# Altium project Brain Storm 2024.PrjPcb
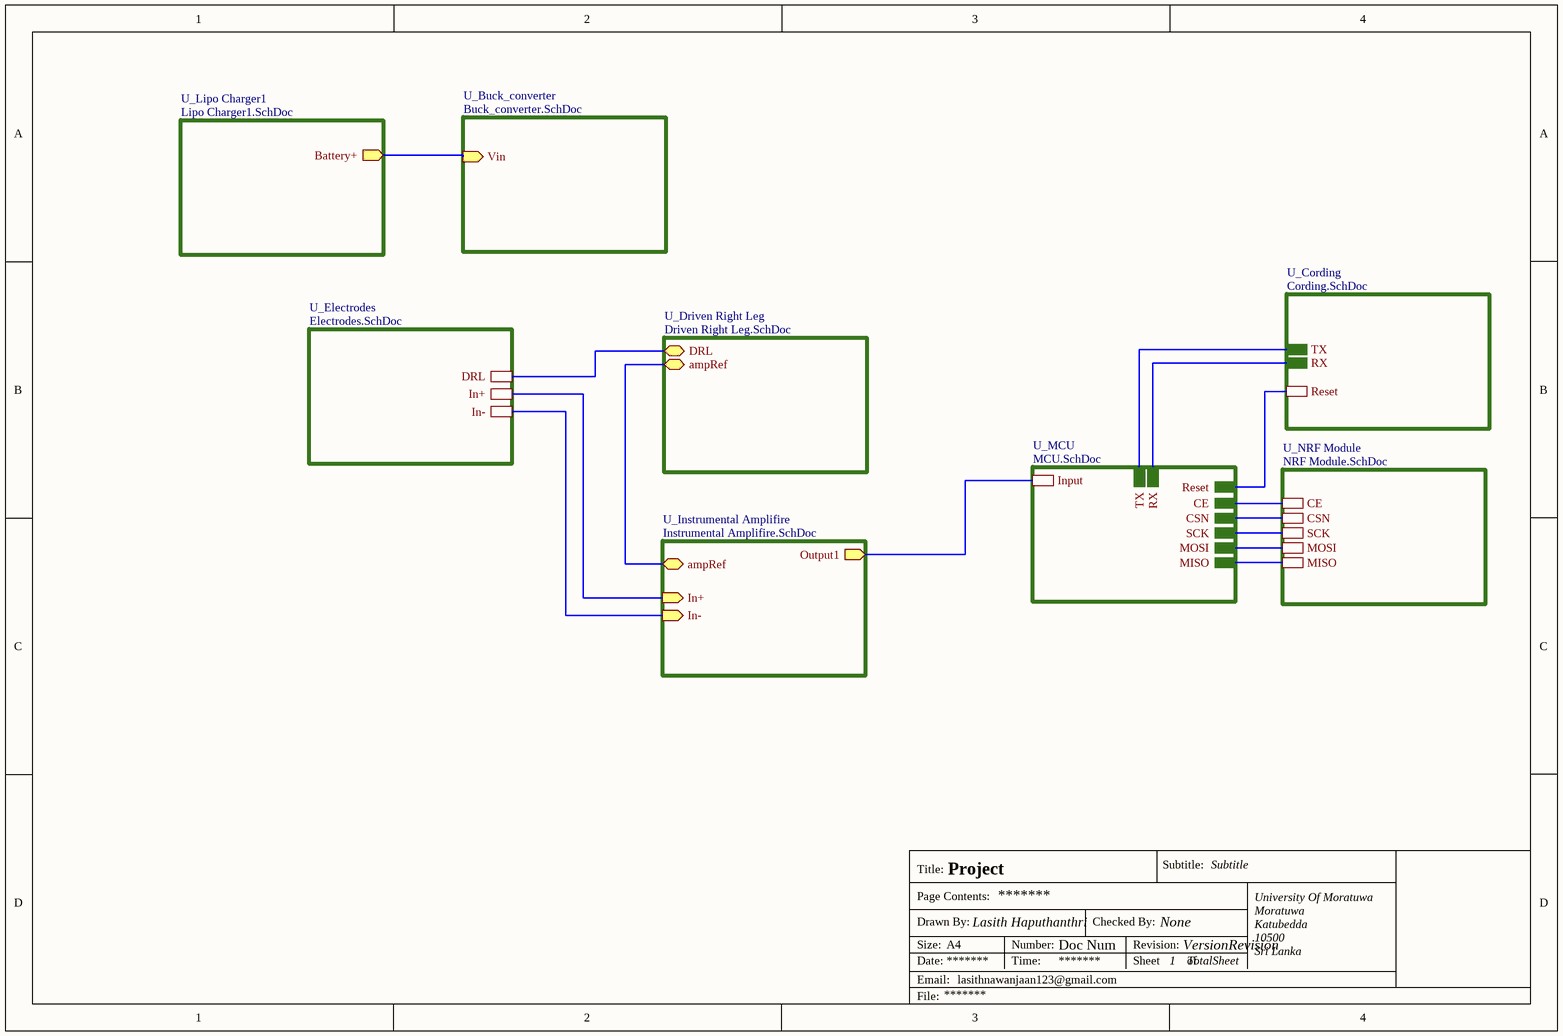
[diagram p0: Spectacles.SchDoc]
8 sheets, 64 parts. Net scope: hierarchical (ports join the sheet entries above them; power ports are global).
Board file: Spectacles.PcbDoc
Sheets:
  Spectacles.SchDoc
    U_Electrodes = Electrodes.SchDoc
    U_Driven Right Leg = Driven Right Leg.SchDoc
    U_Instrumental Amplifire = Instrumental Amplifire.SchDoc
    U_MCU = MCU.SchDoc
    U_NRF Module = NRF Module.SchDoc
    U_Lipo Charger1 = Lipo Charger1.SchDoc
    U_Cording = Cording.SchDoc

## Sheet Spectacles.SchDoc: Title
size A4; Date: *******; ApprovedBy: *******; CheckedBy: None; Author: *******; CompanyName: *******; DrawnBy: Name; Engineer: *******; Organization: *******; Address1: *******; Address2: *******; Address3: *******; Address4: *******; DocumentNumber: Doc Num; Revision: *******; SheetNumber: 1; SheetTotal: 9; Subtitle: Subtitle; Project: Project; VersionRevision: VersionRevision; TotalSheet: TotalSheet; CurrentTime: *******; CurrentDate: *******; Time: *******; DocumentFullPathAndName: *******; DocumentName: *******; ModifiedDate: *******; ImagePath: *******; ProjectName: *******; Application_BuildNumber: *******

### Sub-sheets
U_Buck_converter = Buck_converter.SchDoc (file not in this document): Vin (in)
U_Cording = Cording.SchDoc: Reset, TX, RX
U_Driven Right Leg = Driven Right Leg.SchDoc: DRL (bidir), ampRef (bidir)
U_Electrodes = Electrodes.SchDoc: DRL, In-, In+
U_Instrumental Amplifire = Instrumental Amplifire.SchDoc: In- (in), In+ (in), ampRef (bidir), Output1 (out)
U_Lipo Charger1 = Lipo Charger1.SchDoc: Battery+ (out)
U_MCU = MCU.SchDoc: Input, CE, MOSI, MISO, SCK, CSN, Reset, TX, RX
U_NRF Module = NRF Module.SchDoc: CE, CSN, SCK, MOSI, MISO

### Nets
CE: sheet U_MCU/CE, sheet U_NRF Module/CE
CSN: sheet U_MCU/CSN, sheet U_NRF Module/CSN
MISO: sheet U_MCU/MISO, sheet U_NRF Module/MISO
MOSI: sheet U_MCU/MOSI, sheet U_NRF Module/MOSI
RST: sheet U_MCU/Reset, sheet U_Cording/Reset
SCK: sheet U_MCU/SCK, sheet U_NRF Module/SCK
NetC28_1: sheet U_Lipo Charger1/Battery+, sheet U_Buck_converter/Vin
NetDuty1_1: sheet U_Electrodes/In+, sheet U_Instrumental Amplifire/In+
NetDuty1_2: sheet U_Electrodes/In-, sheet U_Instrumental Amplifire/In-
NetDuty1_3: sheet U_Electrodes/DRL, sheet U_Driven Right Leg/DRL
NetR2_1: sheet U_Driven Right Leg/ampRef, sheet U_Instrumental Amplifire/ampRef
NetR5_1: sheet U_Instrumental Amplifire/Output1, sheet U_MCU/Input
NetR22_1: sheet U_MCU/TX, sheet U_Cording/TX
NetR23_1: sheet U_MCU/RX, sheet U_Cording/RX

### Notes on the sheet
- Title:
- Drawn By:
- Page Contents:
- Checked By:
- Subtitle:
- University Of Moratuwa
- Moratuwa
- Size:
- Date:
- File:
- Email:
- A4
- lasithnawanjaan123@gmail.com
- Lasith Haputhanthri
- Number:
- Time:
- Revision:
- Sheet
- of
- Katubedda
- 10500
- Sri Lanka

## Sheet Electrodes.SchDoc: Title
size A4; Date: *******; ApprovedBy: *******; CheckedBy: None; Author: *******; CompanyName: *******; DrawnBy: Name; Engineer: *******; Organization: *******; Address1: *******; Address2: *******; Address3: *******; Address4: *******; DocumentNumber: Doc Num; Revision: *******; SheetNumber: 2; SheetTotal: 5; Subtitle: Subtitle; Project: Project; VersionRevision: VersionRevision; TotalSheet: TotalSheet; CurrentTime: *******; CurrentDate: *******; Time: *******; DocumentFullPathAndName: *******; DocumentName: *******; ModifiedDate: *******; ImagePath: *******; ProjectName: *******; Application_BuildNumber: *******
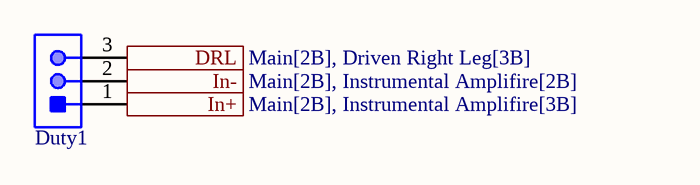
[diagram p1: Electrodes.SchDoc]

### Parts
Duty1  171825-3  [TECO-171825-3_V]  (value not drawn)

### Ports
DRL (see Main[2B], Driven Right Leg[3B]), In+ (see Main[2B], Instrumental Amplifire[3B]), In- (see Main[2B], Instrumental Amplifire[2B])

### Nets
NetDuty1_1: Duty1.1 ; port In+
NetDuty1_2: Duty1.2 ; port In-
NetDuty1_3: Duty1.3 ; port DRL

### Notes on the sheet
- Title:
- Drawn By:
- Page Contents:
- Checked By:
- Subtitle:
- University Of Moratuwa
- Moratuwa
- Size:
- Date:
- File:
- Email:
- A4
- lasithnawanjaan123@gmail.com
- Lasith Haputhanthri
- Number:
- Time:
- Revision:
- Sheet
- of
- Katubedda
- 10500
- Sri Lanka

### Library data of the parts
Duty1 = CMP-2000-07494-1: Male Header, Pitch 2.5 mm, 1 x 3 Position, Height 10.4 mm, Tail Length 3.6 mm, / -20 to 95 degC / , RoHS, Bulk; Manufacturer: TE Connectivity; Mating Alignment: Yes(With); Tail Length: 0.142inch; Mating Post Length: 7.5mm; PCB Thickness: 0.063inch; PCB Mount Alignment: No(Without); Voltage Rating: 350V; Max Voltage Rating (AC): 250V; Plating Thickness: 0.8um; PCB Mounting Orientation: Vertical; Number of Positions: 3; PCB Mount Retention: Without; Max Current Rating: 3.5A; Max Voltage Rating (DC): 350.25kV; Pitch: 2.5mm; Approvals: UL; Contact Resistance: 20mOhm; Mount: ThroughHole; Length: 7.5mm; Orientation: Straight; Contact Mating Length: 0.295inch; Contact Material: Brass; Housing Material: Nylon; Package Description: Male Header, Pitch 2.5 mm, 1 x 3 Position, Height 10.4 mm, Tail Length 3.6 mm; Colour: Natural; Backwall/Post Interruptions: No(Without); Min Operating Temperature: -20degC; Mating Retention: Yes(With); Connector Type: Header; Packaging: Bag; RoHSCompliant: True; Package Reference: 171825-3; Contact Shape: Square; Strain Relief: No(Without); Contact Gender: Male; Number of Contacts: 3; Manufacturer URL: http://www.te.com/; Height: 0.409inch; Contact Retention: No(Without); Datasheet Version: Rev. Y3, 12/2016; Panel Mount Retention: No(Without); Datasheet URL: http://www.te.com/commerce/DocumentDelivery/DDEController?Action=showdoc&DocId=Customer+Drawing%7F171825%7FY3%7Fpdf%7FEnglish%7FENG_CD_171825_Y3.pdf%7F171825-3; Termination: Solder; Mounting Technology: ThroughHole; Max Operating Temperature: 95degC; Flammability Rating: UL94V-0; REACH SVHC: NoSVHC; Housing Colour: Natural; Package Quantity: 1000; Number of Rows: 1; Depth: 4.9mm; Contact Plating: Tin

## Sheet Driven Right Leg.SchDoc: Title
size A4; Date: *******; ApprovedBy: *******; CheckedBy: None; Author: *******; CompanyName: *******; DrawnBy: Name; Engineer: *******; Organization: *******; Address1: *******; Address2: *******; Address3: *******; Address4: *******; DocumentNumber: Doc Num; Revision: *******; SheetNumber: 3; SheetTotal: 9; Subtitle: Subtitle; Project: Project; VersionRevision: VersionRevision; TotalSheet: TotalSheet; CurrentTime: *******; CurrentDate: *******; Time: *******; DocumentFullPathAndName: *******; DocumentName: *******; ModifiedDate: *******; ImagePath: *******; ProjectName: *******; Application_BuildNumber: *******
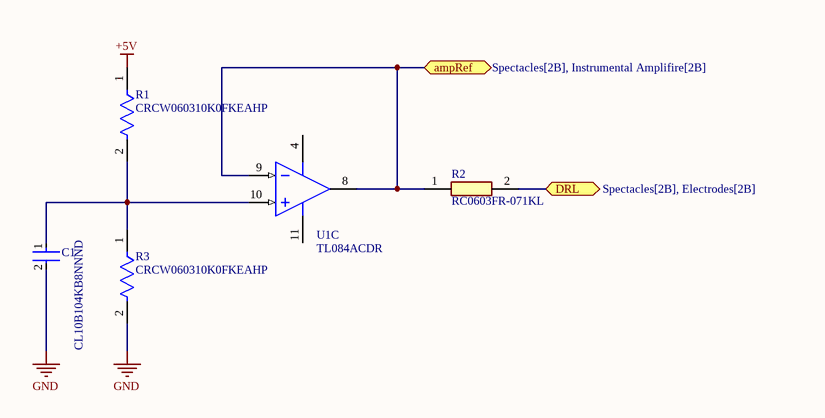
[diagram p2: Driven Right Leg.SchDoc]

### Parts
C1  CL10B104KB8NNND  [FP-CL10-IPC_A]
R1  CRCW060310K0FKEAHP  [FP-CRCW0603-HPe3-MFG]
R2  RC0603FR-071KL  [RESC1608X55N]
R3  CRCW060310K0FKEAHP  [FP-CRCW0603-HPe3-MFG]
U1  TL084ACDR  [D0014A_N]  (part C of 4)

### Ports
ampRef (bidir, see Spectacles[2B], Instrumental Amplifire[2B]), DRL (bidir, see Spectacles[2B], Electrodes[2B])

### Nets
+5V: R1.1 U1.4(VCC+)
GND: C1.2 R3.2 U1.11(VCC-)
NetC1_1: C1.1 R1.2 R3.1 U1.10(IN3+)
NetDuty1_3: R2.2 ; port DRL
NetR2_1: R2.1 U1.8(OUT3) U1.9(IN3-) ; port ampRef

### Notes on the sheet
- Title:
- Drawn By:
- Page Contents:
- Checked By:
- Subtitle:
- University Of Moratuwa
- Moratuwa
- Size:
- Date:
- File:
- Email:
- A4
- lasithnawanjaan123@gmail.com
- Lasith Haputhanthri
- Number:
- Time:
- Revision:
- Sheet
- of
- Katubedda
- 10500
- Sri Lanka

### Library data of the parts
C1 = CMP-13271-000587-1: Cap Ceramic 100nF 50V X7R ±10% Pad SMD 0603 +125°C T/R; Case/Package: 0603; Depth: 0.8mm; Max Operating Temperature: 125°C; Lead Free: Lead Free; Material: Ceramic; Voltage Rating: 50V; Min Operating Temperature: -55°C; Voltage Rating (DC): 50V; Dielectric: X7R; Height: 0.8mm; Capacitance: 100nF; Thickness: 0.035inch; Radiation Hardening: No; Voltage: 50V; Packaging: Tape and Reel; Length: 1.6mm; Tolerance: 10%; Width: 0.031inch; Mount: Surface Mount; Package Quantity: 10000
R1 R3 = CMP-2000-03835-2: RES SMD 10K OHM 1% 1/3W 0603; Resistance: 10kR; Voltage Rating (DC): 75V; Max Power Dissipation: 250mW; Temperature Coefficient: 100ppm/°C; Case Code (Metric): 1608; Features: Automotive AEC-Q200; Termination: SMD/SMT; Number of Terminations: 2; Case Code (Imperial): 0603; Tolerance: 1%; Depth: 0.85mm; Package Quantity: 10; Length: 1.6mm; Packaging: Tape and Reel; Contact Plating: Tin; Radiation Hardening: No; Case/Package: 0603; Composition: Thick Film; Voltage Rating: 75V; Weight: 7.1E-05oz; Max Operating Temperature: 155°C; Lead Free: Lead Free; Width: 0.033inch; Power Rating: 250mW; Min Operating Temperature: -55°C; Military Standard: Not; Height: 0.45mm
R2 = RC0603FR-071KL: Resistor; Manufacturer_Name: YAGEO; Datasheet Link: https://www.yageo.com/upload/media/product/productsearch/datasheet/rchip/PYu-RC_Group_51_RoHS_L_12.pdf; Height: 0.55mm; Manufacturer_Part_Number: RC0603FR-071KL; Mouser Part Number: 603-RC0603FR-071KL; Mouser Price/Stock: https://www.mouser.co.uk/ProductDetail/YAGEO/RC0603FR-071KL?qs=VU8sRB4EgwApHsk4rF%2F3zg%3D%3D; Arrow Part Number: RC0603FR-071KL; Arrow Price/Stock: https://www.arrow.com/en/products/rc0603fr-071kl/yageo?region=nac
U1 = CMP-0015-00026-2: JFET-Input Operational Amplifier, 7 to 36 V, 0 to 70 degC, 14-pin SOIC (D14), Green (RoHS & no Sb/Br); Manufacturer: Texas Instruments; Total Supply Voltage(Min)(+5V is 5, +/-5V is 10): 7; Rating: Catalog; Total Supply Voltage(Max)(+5V is 5, +/-5V is 10): 36; Vio (25C)(Max)(mV): 6; CMRR(Min)(dB): 75; Iq per channel(Max)(mA): 2.8; Offset Drift(Typ)(uV/C): 18; GBW(Typ)(MHz): 3; Slew Rate(Typ)(V/us): 13; Number of Channels: 4; Sub Family: General Purpose Amplifier, High Supply Voltage Amplifier (>=30V); IIB(Max)(pA): 200; Eco-Plan: Green (RoHS & no Sb/Br); ComponentLink2URL: http://www.ti.com/lit/ds/symlink/tl084a.pdf; ComponentLink2Description: Datasheet; PackageVersion: 4040047-5/M, 06/2011; Mounting Technology: Surface Mount; ComponentLink3Description: Package Specification; ComponentLink1Description: Manufacturer URL; PackageReference: D0014A; PartNumber: TL084ACDR; ComponentLink1URL: http://www.ti.com/; ComponentLink3URL: http://www.ti.com/lit/ml/mpds177g/mpds177g.pdf; PackageDescription: 14-Pin Plastic Small Outline, Body 8.65 x 3.90 mm, Pitch 1.27 mm; Code_JEDEC: MS-012; DatasheetVersion: SLOS081G; Vn at 1kHz(Typ)(nV/rtHz): 18

## Sheet Instrumental Amplifire.SchDoc: Title
size A4; Date: *******; ApprovedBy: *******; CheckedBy: None; Author: *******; CompanyName: *******; DrawnBy: Name; Engineer: *******; Organization: *******; Address1: *******; Address2: *******; Address3: *******; Address4: *******; DocumentNumber: Doc Num; Revision: *******; SheetNumber: 4; SheetTotal: 8; Subtitle: Subtitle; Project: Project; VersionRevision: VersionRevision; TotalSheet: TotalSheet; CurrentTime: *******; CurrentDate: *******; Time: *******; DocumentFullPathAndName: *******; DocumentName: *******; ModifiedDate: *******; ImagePath: *******; ProjectName: *******; Application_BuildNumber: *******
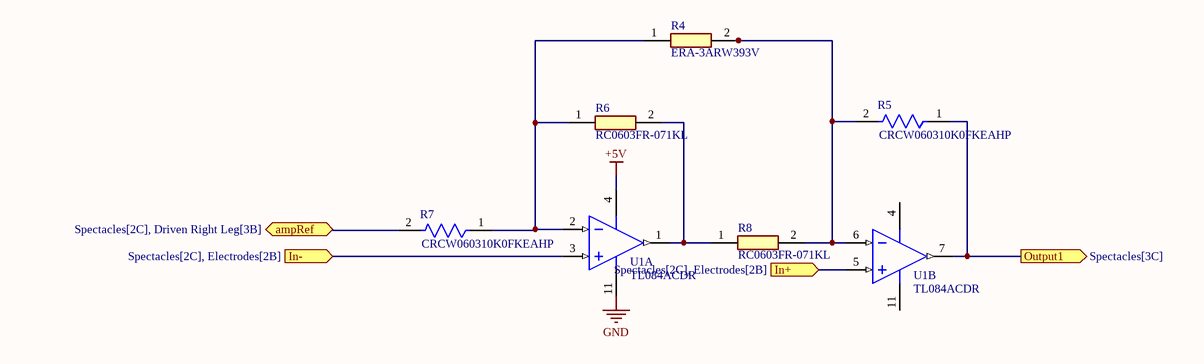
[diagram p3: Instrumental Amplifire.SchDoc]

### Parts
R4  ERA-3ARW393V  [ERA3AEB101V]
R5  CRCW060310K0FKEAHP  [FP-CRCW0603-HPe3-MFG]
R6  RC0603FR-071KL  [RESC1608X55N]
R7  CRCW060310K0FKEAHP  [FP-CRCW0603-HPe3-MFG]
R8  RC0603FR-071KL  [RESC1608X55N]
U1  TL084ACDR  [D0014A_N]  (parts A,B of 4)

### Ports
ampRef (bidir, see Spectacles[2C], Driven Right Leg[3B]), In+ (in, see Spectacles[2C], Electrodes[2B]), In- (in, see Spectacles[2C], Electrodes[2B]), Output1 (out, see Spectacles[3C])

### Nets
+5V: U1.4(VCC+)
GND: U1.11(VCC-)
NetDuty1_1: U1.5(IN2+) ; port In+
NetDuty1_2: U1.3(IN1+) ; port In-
NetR2_1: R7.2 ; port ampRef
NetR4_1: R4.1 R6.1 R7.1 U1.2(IN1-)
NetR4_2: R4.2 R5.2 R8.2 U1.6(IN2-)
NetR5_1: R5.1 U1.7(OUT2) ; port Output1
NetR6_2: R6.2 R8.1 U1.1(OUT1)

### Notes on the sheet
- Title:
- Drawn By:
- Page Contents:
- Checked By:
- Subtitle:
- University Of Moratuwa
- Moratuwa
- Size:
- Date:
- File:
- Email:
- A4
- lasithnawanjaan123@gmail.com
- Lasith Haputhanthri
- Number:
- Time:
- Revision:
- Sheet
- of
- Katubedda
- 10500
- Sri Lanka

### Library data of the parts
R4 = ERA-3ARW393V: Resistor; Manufacturer_Name: Panasonic; Datasheet Link: https://industrial.panasonic.com/cdbs/www-data/pdf/RDM0000/AOA0000C307.pdf; Height: 0.55mm; Manufacturer_Part_Number: ERA-3ARW393V; Mouser Part Number: 667-ERA-3ARW393V; Mouser Price/Stock: https://www.mouser.co.uk/ProductDetail/Panasonic/ERA-3ARW393V?qs=ob%252BdNz2%252BYEhCihxnNm%252BJJA%3D%3D
R5 R7 = CMP-2000-03835-2: as R1 on sheet Driven Right Leg; Case Code (Metric): 1608; Features: Automotive AEC-Q200; Termination: SMD/SMT; Number of Terminations: 2; Case Code (Imperial): 0603; Tolerance: 1%; Depth: 0.85mm; Package Quantity: 10; Length: 1.6mm; Packaging: Tape and Reel; Contact Plating: Tin; Radiation Hardening: No; Case/Package: 0603; Composition: Thick Film; Voltage Rating: 75V; Weight: 7.1E-05oz; Max Operating Temperature: 155°C; Lead Free: Lead Free; Width: 0.033inch; Power Rating: 250mW; Min Operating Temperature: -55°C; Military Standard: Not; Height: 0.45mm
R6 R8 = RC0603FR-071KL: Resistor; Manufacturer_Name: YAGEO; Datasheet Link: https://www.yageo.com/upload/media/product/productsearch/datasheet/rchip/PYu-RC_Group_51_RoHS_L_12.pdf; Height: 0.55mm; Manufacturer_Part_Number: RC0603FR-071KL; Mouser Part Number: 603-RC0603FR-071KL; Mouser Price/Stock: https://www.mouser.co.uk/ProductDetail/YAGEO/RC0603FR-071KL?qs=VU8sRB4EgwApHsk4rF%2F3zg%3D%3D; Arrow Part Number: RC0603FR-071KL; Arrow Price/Stock: https://www.arrow.com/en/products/rc0603fr-071kl/yageo?region=nac
U1 = CMP-0015-00026-2: as U1 on sheet Driven Right Leg; Eco-Plan: Green (RoHS & no Sb/Br); ComponentLink2URL: http://www.ti.com/lit/ds/symlink/tl084a.pdf; ComponentLink2Description: Datasheet; PackageVersion: 4040047-5/M, 06/2011; Mounting Technology: Surface Mount; ComponentLink3Description: Package Specification; ComponentLink1Description: Manufacturer URL; PackageReference: D0014A; PartNumber: TL084ACDR; ComponentLink1URL: http://www.ti.com/; ComponentLink3URL: http://www.ti.com/lit/ml/mpds177g/mpds177g.pdf; PackageDescription: 14-Pin Plastic Small Outline, Body 8.65 x 3.90 mm, Pitch 1.27 mm; Code_JEDEC: MS-012; DatasheetVersion: SLOS081G; Vn at 1kHz(Typ)(nV/rtHz): 18

## Sheet MCU.SchDoc: Title
size A4; Date: *******; ApprovedBy: *******; CheckedBy: None; Author: *******; CompanyName: *******; DrawnBy: Name; Engineer: *******; Organization: *******; Address1: *******; Address2: *******; Address3: *******; Address4: *******; DocumentNumber: Doc Num; Revision: *******; SheetNumber: 5; SheetTotal: 9; Subtitle: Subtitle; Project: Project; VersionRevision: VersionRevision; TotalSheet: TotalSheet; CurrentTime: *******; CurrentDate: *******; Time: *******; DocumentFullPathAndName: *******; DocumentName: *******; ModifiedDate: *******; ImagePath: *******; ProjectName: *******; Application_BuildNumber: *******
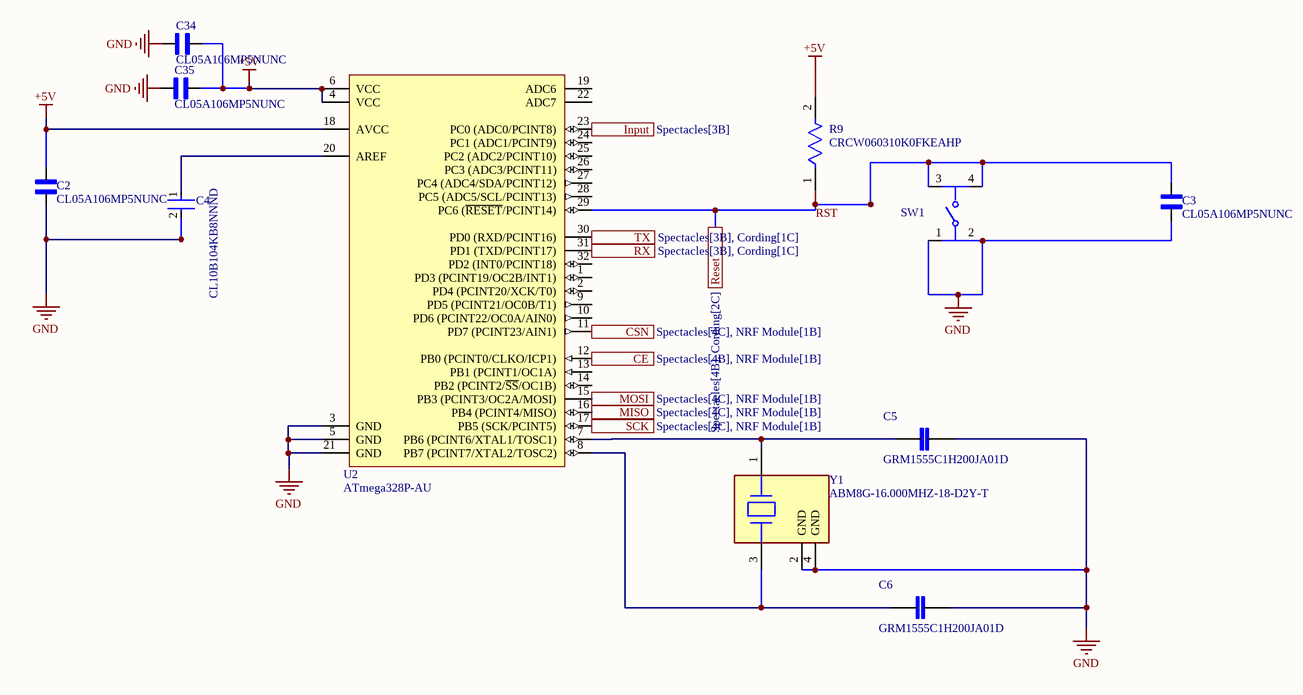
[diagram p4: MCU.SchDoc]

### Parts
C2  CL05A106MP5NUNC  [CAPC1005X55N]
C3  CL05A106MP5NUNC  [CAPC1005X55N]
C4  CL10B104KB8NNND  [FP-CL10-IPC_A]
C5  GRM1555C1H200JA01D  [CAPC1005X55N]
C6  GRM1555C1H200JA01D  [CAPC1005X55N]
C34  CL05A106MP5NUNC  [CAPC1005X55N]
C35  CL05A106MP5NUNC  [CAPC1005X55N]
R9  CRCW060310K0FKEAHP  [FP-CRCW0603-HPe3-MFG]
SW1  PTS526SK15SMTR2LFS  [FP-PTS526SK15SMTR2LFS-MFG]  (value not drawn)
U2  ATmega328P-AU  [32A_M]
Y1  ABM8G-16.000MHZ-18-D2Y-T  [FP-ABM8G-MFG]

### Ports
CE (see Spectacles[4B], NRF Module[1B]), CSN (see Spectacles[4C], NRF Module[1B]), Input (see Spectacles[3B]), MISO (see Spectacles[4C], NRF Module[1B]), MOSI (see Spectacles[4C], NRF Module[1B]), Reset (see Spectacles[4B], Cording[2C]), RX (see Spectacles[3B], Cording[1C]), SCK (see Spectacles[4C], NRF Module[1B]), TX (see Spectacles[3B], Cording[1C])

### Nets
+5V: C2.2 C34.1 C35.1 R9.2 U2.4(VCC) U2.6(VCC) U2.18(AVCC)
GND: C2.1 C3.1 C4.2 C5.1 C6.1 C34.2 C35.2 SW1.1 SW1.2 U2.3(GND) U2.5(GND) U2.21(GND) Y1.2(GND) Y1.4(GND)
CE: U2.12(PB0_(PCINT0/CLKO/ICP1)) ; port CE
CSN: U2.11(PD7_(PCINT23/AIN1)) ; port CSN
MISO: U2.16(PB4_(PCINT4/MISO)) ; port MISO
MOSI: U2.15(PB3_(PCINT3/OC2A/MOSI)) ; port MOSI
RST: C3.2 R9.1 SW1.3 SW1.4 U2.29(PC6_(~{RESET}/PCINT14)) ; port Reset
SCK: U2.17(PB5_(SCK/PCINT5)) ; port SCK
NetC4_1: C4.1 U2.20(AREF)
NetC5_2: C5.2 U2.7(PB6_(PCINT6/XTAL1/TOSC1)) Y1.1
NetC6_2: C6.2 U2.8(PB7_(PCINT7/XTAL2/TOSC2)) Y1.3
NetR5_1: U2.23(PC0_(ADC0/PCINT8)) ; port Input
NetR22_1: U2.30(PD0_(RXD/PCINT16)) ; port TX
NetR23_1: U2.31(PD1_(TXD/PCINT17)) ; port RX

Not connected (* = marked no-connect by the designer): U2 1(PD3_(PCINT19/OC2B/INT1)) 2(PD4_(PCINT20/XCK/T0)) 9(PD5_(PCINT21/OC0B/T1)) 10(PD6_(PCINT22/OC0A/AIN0)) 13(PB1_(PCINT1/OC1A)) 14(PB2_(PCINT2/~{SS}/OC1B)) 19(ADC6) 22(ADC7) 24(PC1_(ADC1/PCINT9)) 25(PC2_(ADC2/PCINT10)) 26(PC3_(ADC3/PCINT11)) 27(PC4_(ADC4/SDA/PCINT12)) 28(PC5_(ADC5/SCL/PCINT13)) 32(PD2_(INT0/PCINT18))

### Notes on the sheet
- Title:
- Drawn By:
- Page Contents:
- Checked By:
- Subtitle:
- University Of Moratuwa
- Moratuwa
- Size:
- Date:
- File:
- Email:
- A4
- lasithnawanjaan123@gmail.com
- Lasith Haputhanthri
- Number:
- Time:
- Revision:
- Sheet
- of
- Katubedda
- 10500
- Sri Lanka

### Library data of the parts
C2 C3 C34 C35 = CL05A106MP5NUNC: 10 ÂµF Â±20% 10V Ceramic Capacitor X5R 0402 (1005 Metric); Manufacturer Part Number: GRM188R61A106KE69D; Manufacturer: Murata; Temperature Coefficient: 15%; Capacitance: 10uF; Tolerance: 10%; MF: Samsung Electro-Mechanics; Package: 0402 Samsung; Value: *; Device Class L1: Passive Components; ComponentLink2Description: Datasheet; Height: 0.95mm; Octopart: https://octopart.com/grm188r61a106ke69d-murata-22851381; Digikey Description: CAP CER 10UF 10V X5R 0603; Temperature Range High: +85°C; Temperature Range Low: -55°C; Temperature Characteristic: X5R; RoHS: TRUE; Material: Ceramic; Device Class L2: Capacitors; ComponentLink2URL: https://search.murata.co.jp/Ceramy/image/img/A01X/G101/ENG/GRM188R61A106KE69-01A.pdf; Device Class L3: Ceramic Capacitors; Lead Free: Yes; Mouser Description: Multilayer Ceramic Capacitors MLCC - SMD/SMT 0603 10uF 10volts X5R + - 10%; Category: Cap; Voltage Rating: 10V; Temperature: -55°C to +85°C; Automotive: No; Check_prices: https://www.snapeda.com/parts/CL05A106MP5NUNC/Samsung+Electro-Mechanics/view-part/?ref=eda; MP: CL05A106MP5NUNC; SnapEDA_Link: https://www.snapeda.com/parts/CL05A106MP5NUNC/Samsung+Electro-Mechanics/view-part/?ref=snap
C4 = CMP-13271-000587-1: as C1 on sheet Driven Right Leg; Case/Package: 0603; Depth: 0.8mm; Max Operating Temperature: 125°C; Lead Free: Lead Free; Material: Ceramic; Voltage Rating: 50V; Min Operating Temperature: -55°C; Voltage Rating (DC): 50V; Dielectric: X7R; Height: 0.8mm; Capacitance: 100nF; Thickness: 0.035inch; Radiation Hardening: No; Voltage: 50V; Packaging: Tape and Reel; Length: 1.6mm; Tolerance: 10%; Width: 0.031inch; Mount: Surface Mount; Package Quantity: 10000
C5 C6 = GRM1555C1H200JA01D: SMD Capacitor C0G(EIA) with Capacitance: 20pF Tol. 5%. Rated Voltage: 50Vdc; MF: Murata; Check_prices: https://www.snapeda.com/parts/GRM1555C1H200JA01D/Murata+Electronics+North+America/view-part/?ref=eda; MP: GRM1555C1H200JA01D; Package: 1005 Taiyo Yuden; SnapEDA_Link: https://www.snapeda.com/parts/GRM1555C1H200JA01D/Murata+Electronics+North+America/view-part/?ref=snap; Value: *
R9 = CMP-2000-03835-2: as R1 on sheet Driven Right Leg; Case Code (Metric): 1608; Features: Automotive AEC-Q200; Termination: SMD/SMT; Number of Terminations: 2; Case Code (Imperial): 0603; Tolerance: 1%; Depth: 0.85mm; Package Quantity: 10; Length: 1.6mm; Packaging: Tape and Reel; Contact Plating: Tin; Radiation Hardening: No; Case/Package: 0603; Composition: Thick Film; Voltage Rating: 75V; Weight: 7.1E-05oz; Max Operating Temperature: 155°C; Lead Free: Lead Free; Width: 0.033inch; Power Rating: 250mW; Min Operating Temperature: -55°C; Military Standard: Not; Height: 0.45mm
SW1 = CMP-10040-000013-1: TACT 5.2 X 5.2, 1.5 MM H, 260GF,; Manufacturer: C&K; Operating Force: 250gf; Throw Configuration: SPST-NO; Contact Current Rating: 50mA; Standoff Height: 0mm; Contact Resistance: 100mΩ; Voltage Rating Dc: 12V; Electromechanical Life: 200000Cycles; Device Class L3: Tactile Switches; Device Class L2: Switches; Temperature: -20°C to +70°C; Temperature Range Low: -20°C; Package: PTS526SK15SMTR2LFS; Temperature Range High: +70°C; ComponentLink2Description: Datasheet; Device Class L1: Electromechanical; Height: 1.65mm; Digikey Description: TACT 5.2 X 5.2, 1.5 MM H, 260GF,; Category: Switch; RoHS: TRUE; Automotive: No; Lead Free: Yes; Manufacturer Part Number: PTS526SK15SMTR2LFS; Octopart: https://octopart.com/pts526+sk15+smtr2+lfs-c%26k+components-100617999; ComponentLink2URL: https://www.ckswitches.com/media/2780/pts526.pdf
U2 = CMP-0095-00269-2: 8-bit AVR Microcontroller, 32KB Flash, 1KB EEPROM, 2KB SRAM, 32-pin TQFP, Industrial Grade (-40°C to 85°C); PackageDescription: 32-Lead, 7x7x1.0 mm Body, 0.8mm Lead Pitch, Thin Profile Plastic Quad Flat Package (TQFP); DatasheetVersion: revD, May-2011; RevisionNote: DatasheetVersion & PackageVersion updated. URLs added.; ComponentLink1URL: http://www.atmel.com/; ComponentLink2Description: ATmega48A/48PA/88A/88PA/168A/168PA/328/328P Datasheet; Code_JEDEC: MS-026-ABA; ComponentLink1Description: Manufacturer URL; PackageReference: 32A; ComponentLink3Description: ATmega48A/48PA/88A/88PA/168A/168PA/328/328P Summary; ComponentLink2URL: http://www.atmel.com/dyn/resources/prod_documents/doc8271.pdf; PackageVersion: revC, Oct-2010; ComponentLink3URL: http://www.atmel.com/dyn/resources/prod_documents/8271S.pdf
Y1 = CMP-2000-05039-3: Crystal 12MHz ±20ppm (Tol) ±30ppm (Stability) 18pF FUND 120Ω 4-Pin SMD T/R; Series Resistance: 120R; Max Operating Temperature: 85°C; Mount: Surface Mount; Width: 2.5mm; Series: ABM8G; Termination: SMD/SMT; Frequency Tolerance: 20ppm; Tolerance: 20ppm; Min Operating Temperature: -40°C; Operating Frequency: 12 MHz; Depth: 2.5mm; Load Capacitance: 18pF; Number of Pins: 4; Length: 3.2mm; Radiation Hardening: No; Frequency Stability: 30ppm; Height: 1mm; Packaging: Tape and Reel; Package Quantity: 1000; ESR (Equivalent Series Resistance): 120R; Lead Free: Lead Free; Frequency: 12MHz; Case/Package: CSMD

## Sheet NRF Module.SchDoc: Title
size A4; Date: *******; ApprovedBy: *******; CheckedBy: None; Author: *******; CompanyName: *******; DrawnBy: Name; Engineer: *******; Organization: *******; Address1: *******; Address2: *******; Address3: *******; Address4: *******; DocumentNumber: Doc Num; Revision: *******; SheetNumber: 7; SheetTotal: 9; Subtitle: Subtitle; Project: Project; VersionRevision: VersionRevision; TotalSheet: TotalSheet; CurrentTime: *******; CurrentDate: *******; Time: *******; DocumentFullPathAndName: *******; DocumentName: *******; ModifiedDate: *******; ImagePath: *******; ProjectName: *******; Application_BuildNumber: *******
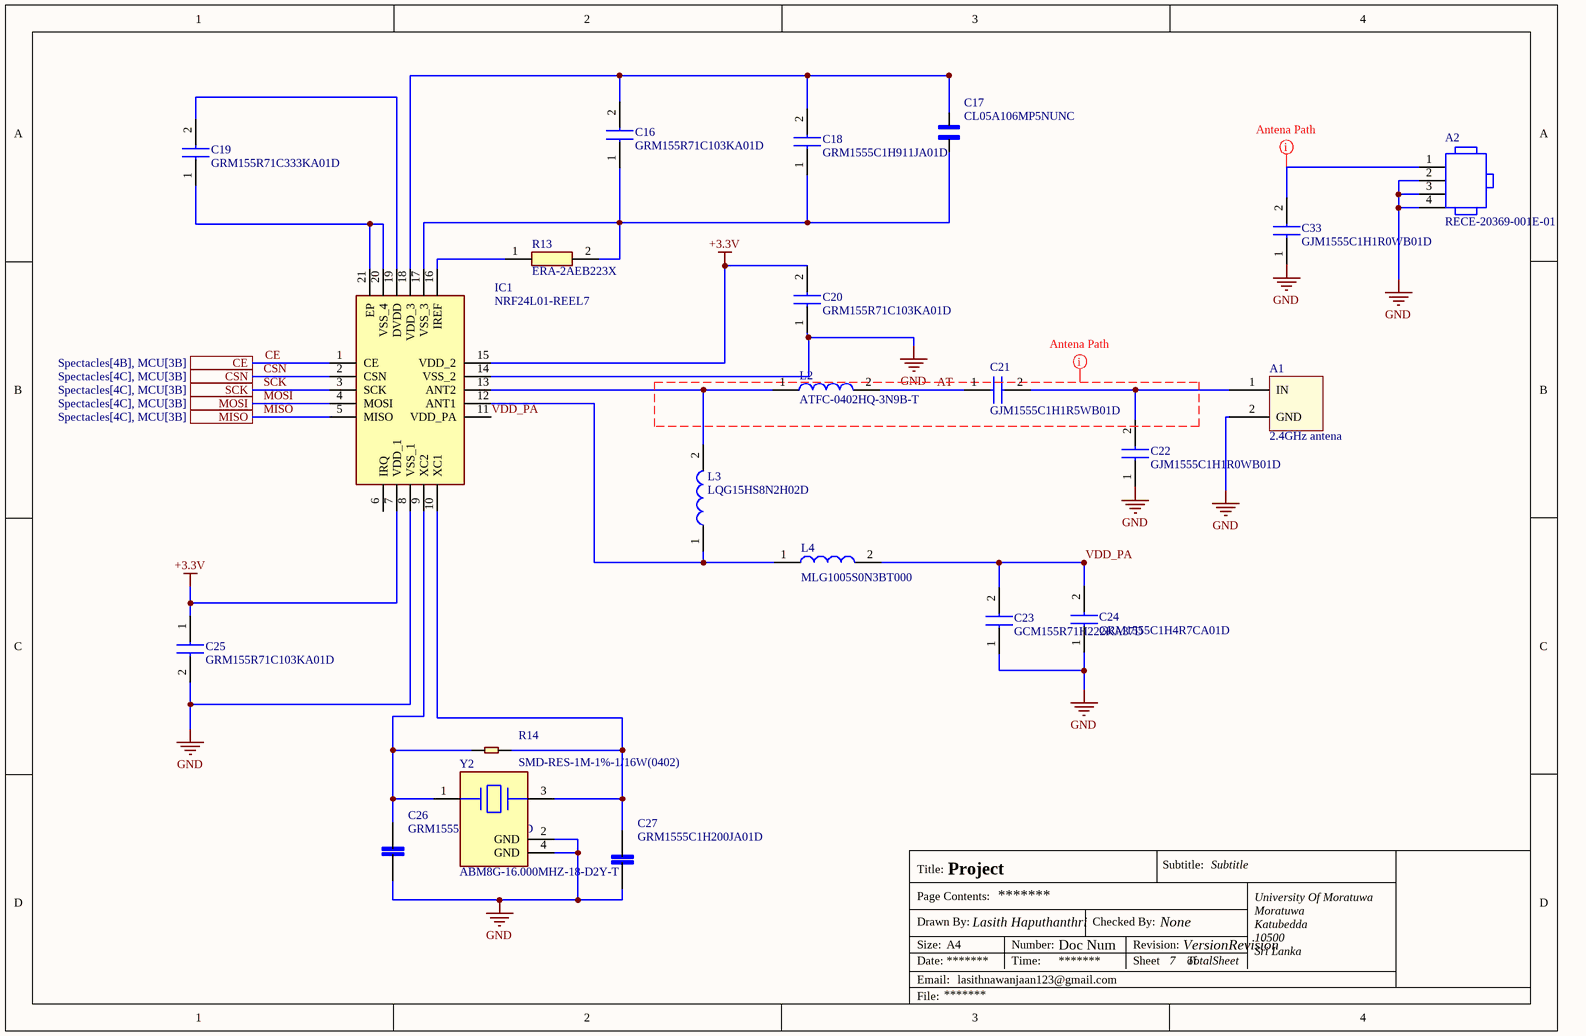
[diagram p5: NRF Module.SchDoc]

### Parts
A1  2.4GHz antena  [Antena]  (net tie, no BOM)
A2  RECE-20369-001E-01  [TG-RECE-20369-001E-4_V]
C16  GRM155R71C103KA01D  [CAPC1005X55N]
C17  CL05A106MP5NUNC  [CAPC1005X55N]
C18  GRM1555C1H911JA01D  [CAPC1005X55N]
C19  GRM155R71C333KA01D  [CAPC1005X55N]
C20  GRM155R71C103KA01D  [CAPC1005X55N]
C21  GJM1555C1H1R5WB01D  [CAPC1005X55N]
C22  GJM1555C1H1R0WB01D  [CAPC1005X55N]
C23  GCM155R71H222KA37D  [CAPC1005X55N]
C24  GRM1555C1H4R7CA01D  [CAPC1005X55N]
C25  GRM155R71C103KA01D  [CAPC1005X55N]
C26  GRM1555C1H200JA01D  [CAPC1005X55N]
C27  GRM1555C1H200JA01D  [CAPC1005X55N]
C33  GJM1555C1H1R0WB01D  [CAPC1005X55N]
IC1  NRF24L01-REEL7  [QFN50P400X400X80-21N-D]
L2  ATFC-0402HQ-3N9B-T  [INDC1005X37N]
L3  LQG15HS8N2H02D  [LQG15WH0N7B02D]
L4  MLG1005S0N3BT000  [MLG1005]
R13  ERA-2AEB223X  [ERA2AED122X]
R14  SMD-RES-1M-1%-1/16W(0402)  [R0402]
Y2  ABM8G-16.000MHZ-18-D2Y-T  [FP-ABM8G-MFG]

### Ports
CE (see Spectacles[4B], MCU[3B]), CSN (see Spectacles[4C], MCU[3B]), MISO (see Spectacles[4C], MCU[3B]), MOSI (see Spectacles[4C], MCU[3B]), SCK (see Spectacles[4C], MCU[3B])

### Nets
+3.3V: C20.2 C25.1 IC1.7(VDD_1) IC1.15(VDD_2)
GND: A1.2(GND) A2.2 A2.3 A2.4 C20.1 C22.1 C23.1 C24.1 C25.2 C26.1 C27.1 C33.1 IC1.8(VSS_1) IC1.14(VSS_2) Y2.2(GND) Y2.4(GND)
AT: C21.1 L2.2
CE: IC1.1(CE) ; port CE
CSN: IC1.2(CSN) ; port CSN
MISO: IC1.5(MISO) ; port MISO
MOSI: IC1.4(MOSI) ; port MOSI
SCK: IC1.3(SCK) ; port SCK
VDD_PA: C23.2 C24.2 IC1.11(VDD_PA) L4.2
NetA1_1: A1.1(IN) C21.2 C22.2
NetA2_1: A2.1 C33.2
NetC16_1: C16.1 C17.1 C18.1 IC1.17(VSS_3) R13.2
NetC16_2: C16.2 C17.2 C18.2 IC1.18(VDD_3)
NetC19_1: C19.1 IC1.20(VSS_4) IC1.21(EP)
NetC19_2: C19.2 IC1.19(DVDD)
NetC26_2: C26.2 IC1.9(XC2) R14.1 Y2.1
NetC27_2: C27.2 IC1.10(XC1) R14.2 Y2.3
NetIC1_12: IC1.12(ANT1) L3.1 L4.1
NetIC1_13: IC1.13(ANT2) L2.1 L3.2
NetIC1_16: IC1.16(IREF) R13.1

Not connected (* = marked no-connect by the designer): IC1 6(IRQ)

### Layout directives
net class Antena: AT, NetA2_1

### Notes on the sheet
- Title:
- Drawn By:
- Page Contents:
- Checked By:
- Subtitle:
- University Of Moratuwa
- Moratuwa
- Size:
- Date:
- File:
- Email:
- A4
- lasithnawanjaan123@gmail.com
- Lasith Haputhanthri
- Number:
- Time:
- Revision:
- Sheet
- of
- Katubedda
- 10500
- Sri Lanka

### Library data of the parts
A2 = CMP-0275-00001-2: RF Connector, Onboard Receptacle, IPEX MHFIII; Manufacturer: Taoglas; Packing: Tape and Reel; Mounting Technology: Surface Mount; PackageReference: RECE-20369-001E-01-4; ComponentLink1URL: http://www.taoglas.com/; Housing Color: Gold; DatasheetVersion: Rev. C; ComponentLink2URL: http://www.taoglas.com/images/product_images/original_images/RECE.20369.001E.01.pdf; ComponentLink3Description: Package Specification; PackageVersion: Rev. C; ComponentLink1Description: Manufacturer URL; ComponentLink2Description: Datasheet; PackageDescription: 4-Pin, Hand Drawn, Body 1.7x1.7mm; ComponentLink3URL: http://www.taoglas.com/images/product_images/original_images/RECE.20369.001E.01.pdf; PartNumber: RECE-20369-001E-01
C16 C20 C25 = GRM155R71C103KA01D: Capacitor; Manufacturer_Name: Murata Electronics; Datasheet Link: http://www.murata.com/~/media/webrenewal/support/library/catalog/products/capacitor/mlcc/c02e.pdf; Height: 0.55mm; Manufacturer_Part_Number: GRM155R71C103KA01D; Mouser Part Number: 81-GRM36X103K16; Mouser Price/Stock: https://www.mouser.co.uk/ProductDetail/Murata-Electronics/GRM155R71C103KA01D?qs=8YPuuxuUzMI%252B9QLnzeLwhQ%3D%3D; Arrow Part Number: GRM155R71C103KA01D; Arrow Price/Stock: https://www.arrow.com/en/products/grm155r71c103ka01d/murata-manufacturing?region=europe
C17 = CL05A106MP5NUNC: 10 ÂµF Â±20% 10V Ceramic Capacitor X5R 0402 (1005 Metric); MF: Samsung Electro-Mechanics; Check_prices: https://www.snapeda.com/parts/CL05A106MP5NUNC/Samsung+Electro-Mechanics/view-part/?ref=eda; MP: CL05A106MP5NUNC; Package: 0402 Samsung; SnapEDA_Link: https://www.snapeda.com/parts/CL05A106MP5NUNC/Samsung+Electro-Mechanics/view-part/?ref=snap; Value: *
C18 = GRM1555C1H911JA01D: Capacitor; Manufacturer_Name: Murata Electronics; Datasheet Link: http://www.murata.com/~/media/webrenewal/support/library/catalog/products/capacitor/mlcc/c02e.pdf; Height: 0.55mm; Manufacturer_Part_Number: GRM1555C1H911JA01D; Mouser Part Number: 81-GRM1555C1H911JA1D; Mouser Price/Stock: https://www.mouser.co.uk/ProductDetail/Murata-Electronics/GRM1555C1H911JA01D?qs=p6VZ%252BklCkRTpKNdGAzqH7g%3D%3D
C19 = GRM155R71C333KA01D: Capacitor; Manufacturer_Name: Murata Electronics; Datasheet Link: http://www.murata.com/~/media/webrenewal/support/library/catalog/products/capacitor/mlcc/c02e.pdf; Height: 0.55mm; Manufacturer_Part_Number: GRM155R71C333KA01D; Arrow Part Number: GRM155R71C333KA01D; Arrow Price/Stock: https://www.arrow.com/en/products/grm155r71c333ka01d/murata-manufacturing
C21 = GJM1555C1H1R5WB01D: Capacitor; Manufacturer_Name: Murata Electronics; Datasheet Link: https://psearch.en.murata.com/capacitor/product/GJM1555C1H1R5WB01%23.html; Height: 0.55mm; Manufacturer_Part_Number: GJM1555C1H1R5WB01D; Mouser Part Number: 81-GJM1555C1H1R5WB1D; Mouser Price/Stock: https://www.mouser.co.uk/ProductDetail/Murata-Electronics/GJM1555C1H1R5WB01D?qs=YLLXL5qGyDucsRPozQcunA%3D%3D; Arrow Part Number: GJM1555C1H1R5WB01D; Arrow Price/Stock: https://www.arrow.com/en/products/gjm1555c1h1r5wb01d/murata-manufacturing?region=nac
C22 C33 = GJM1555C1H1R0WB01D: Capacitor; Manufacturer_Name: Murata Electronics; Datasheet Link: https://psearch.en.murata.com/capacitor/product/GJM1555C1H1R0WB01%23.html; Height: 0.55mm; Manufacturer_Part_Number: GJM1555C1H1R0WB01D; Mouser Part Number: 81-GJM1555C1H1R0WB1D; Mouser Price/Stock: https://www.mouser.co.uk/ProductDetail/Murata-Electronics/GJM1555C1H1R0WB01D?qs=YLLXL5qGyDtaruZHJwTPNg%3D%3D; Arrow Part Number: GJM1555C1H1R0WB01D; Arrow Price/Stock: https://www.arrow.com/en/products/gjm1555c1h1r0wb01d/murata-manufacturing?region=nac
C23 = GCM155R71H222KA37D: Capacitor; Manufacturer_Name: Murata Electronics; Datasheet Link: https://psearch.en.murata.com/capacitor/product/GCM155R71H222KA37%23.html; Height: 0.55mm; Manufacturer_Part_Number: GCM155R71H222KA37D; Mouser Part Number: 81-GCM155R71H222K37D; Mouser Price/Stock: https://www.mouser.co.uk/ProductDetail/Murata-Electronics/GCM155R71H222KA37D?qs=QDXoN8f0aYKEsLYYwicpIw%3D%3D; Arrow Part Number: GCM155R71H222KA37D; Arrow Price/Stock: https://www.arrow.com/en/products/gcm155r71h222ka37d/murata-manufacturing?region=nac
C24 = GRM1555C1H4R7CA01D: Capacitor; Manufacturer_Name: Murata Electronics; Datasheet Link: http://www.murata.com/~/media/webrenewal/support/library/catalog/products/capacitor/mlcc/c02e.pdf; Height: 0.55mm; Manufacturer_Part_Number: GRM1555C1H4R7CA01D; Mouser Part Number: 81-GRM1555C1H4R7CA1D; Mouser Price/Stock: https://www.mouser.co.uk/ProductDetail/Murata-Electronics/GRM1555C1H4R7CA01D?qs=4k9rjS6ZRl7tSQRzstyMVg%3D%3D; Arrow Part Number: GRM1555C1H4R7CA01D; Arrow Price/Stock: https://www.arrow.com/en/products/grm1555c1h4r7ca01d/murata-manufacturing
C26 C27 = GRM1555C1H200JA01D: as C5 on sheet MCU; Check_prices: https://www.snapeda.com/parts/GRM1555C1H200JA01D/Murata+Electronics+North+America/view-part/?ref=eda; MP: GRM1555C1H200JA01D; Package: 1005 Taiyo Yuden; SnapEDA_Link: https://www.snapeda.com/parts/GRM1555C1H200JA01D/Murata+Electronics+North+America/view-part/?ref=snap; Value: *
IC1 = NRF24L01-REEL7: Integrated Circuit; Manufacturer_Name: Nordic Semiconductor; Datasheet Link: https://4donline.ihs.com/images/VipMasterIC/IC/NRSA/NRSAS00020/NRSAS00020-1.pdf?hkey=EF798316E3902B6ED9A73243A3159BB0; Height: 0.8mm; Manufacturer_Part_Number: NRF24L01-REEL7; Mouser Part Number: 949-NRF24L01-REEL7; Mouser Price/Stock: https://www.mouser.co.uk/ProductDetail/Nordic-Semiconductor/nRF24L01-REEL7?qs=yd0qOhnSiDfNM3Q865kckA%3D%3D; Arrow Part Number: NRF24L01-REEL7; Arrow Price/Stock: null?region=nac
L2 = ATFC-0402HQ-3N9B-T: Inductor; Manufacturer_Name: ABRACON; Datasheet Link: https://abracon.com/Magnetics/inductors/ATFC-0402HQ.pdf; Height: 0.37mm; Manufacturer_Part_Number: ATFC-0402HQ-3N9B-T
L3 = LQG15HS8N2H02D: Inductor; Manufacturer_Name: Murata Electronics; Datasheet Link: https://psearch.en.murata.com/inductor/product/LQG15HS8N2H02%23.html; Height: 0.55mm; Manufacturer_Part_Number: LQG15HS8N2H02D; Mouser Part Number: 81-LQG15HS8N2H02D; Mouser Price/Stock: https://www.mouser.co.uk/ProductDetail/Murata-Electronics/LQG15HS8N2H02D?qs=60uY6ySkanTiptaknJqb2Q%3D%3D; Arrow Part Number: LQG15HS8N2H02D; Arrow Price/Stock: https://www.arrow.com/en/products/lqg15hs8n2h02d/murata-manufacturing
L4 = MLG1005S0N3BT000: Inductor; Manufacturer_Name: TDK; Datasheet Link: https://product.tdk.com/system/files/dam/doc/product/inductor/inductor/smd/catalog/inductor_commercial_high-frequency_mlg1005s_en.pdf; Manufacturer_Part_Number: MLG1005S0N3BT000; Mouser Part Number: 810-MLG1005S0N3BT000; Mouser Price/Stock: https://www.mouser.co.uk/ProductDetail/TDK/MLG1005S0N3BT000?qs=u4%252BEJ9urDASg1T%252BCePJhFw%3D%3D; Arrow Part Number: MLG1005S0N3BT000; Arrow Price/Stock: https://www.arrow.com/en/products/mlg1005s0n3bt000/tdk
R13 = ERA-2AEB223X: Resistor; Manufacturer_Name: Panasonic; Datasheet Link: http://industrial.panasonic.com/cdbs/www-data/pdf/RDM0000/AOA0000C307.pdf; Height: 0.4mm; Manufacturer_Part_Number: ERA-2AEB223X; Mouser Part Number: 667-ERA-2AEB223X; Mouser Price/Stock: https://www.mouser.co.uk/ProductDetail/Panasonic/ERA-2AEB223X?qs=YFwoyZoVY0gOqA4AmOyJ2g%3D%3D; Arrow Part Number: ERA-2AEB223X; Arrow Price/Stock: https://www.arrow.com/en/products/era2aeb223x/panasonic?region=europe
R14 = SMD-RES-1M-1%-1/16W(0402): 1 MOhms Â±1% 0.063W, 1/16W Chip Resistor 0402 (1005 Metric) Moisture Resistant Thick Film; MF: Yageo; MP: RC0402FR-071ML; Availability: In Stock; Check_prices: https://www.snapeda.com/parts/RC0402FR-071ML/Yageo/view-part/?ref=eda; Package: 0402 Yageo; Price: None; Purchase-URL: https://pricing.snapeda.com/search/part/RC0402FR-071ML/?ref=eda; SnapEDA_Link: https://www.snapeda.com/parts/RC0402FR-071ML/Yageo/view-part/?ref=snap; Value: *
Y2 = CMP-2000-05039-3: as Y1 on sheet MCU; Max Operating Temperature: 85°C; Mount: Surface Mount; Width: 2.5mm; Series: ABM8G; Termination: SMD/SMT; Frequency Tolerance: 20ppm; Tolerance: 20ppm; Min Operating Temperature: -40°C; Operating Frequency: 12 MHz; Depth: 2.5mm; Load Capacitance: 18pF; Number of Pins: 4; Length: 3.2mm; Radiation Hardening: No; Frequency Stability: 30ppm; Height: 1mm; Packaging: Tape and Reel; Package Quantity: 1000; ESR (Equivalent Series Resistance): 120R; Lead Free: Lead Free; Frequency: 12MHz; Case/Package: CSMD

## Sheet Lipo Charger1.SchDoc: Title
size A4; Date: *******; ApprovedBy: *******; CheckedBy: None; Author: *******; CompanyName: *******; DrawnBy: Name; Engineer: *******; Organization: *******; Address1: *******; Address2: *******; Address3: *******; Address4: *******; DocumentNumber: Doc Num; Revision: *******; SheetNumber: 8; SheetTotal: 9; Subtitle: Subtitle; Project: Project; VersionRevision: VersionRevision; TotalSheet: TotalSheet; CurrentTime: *******; CurrentDate: *******; Time: *******; DocumentFullPathAndName: *******; DocumentName: *******; ModifiedDate: *******; ImagePath: *******; ProjectName: *******; Application_BuildNumber: *******
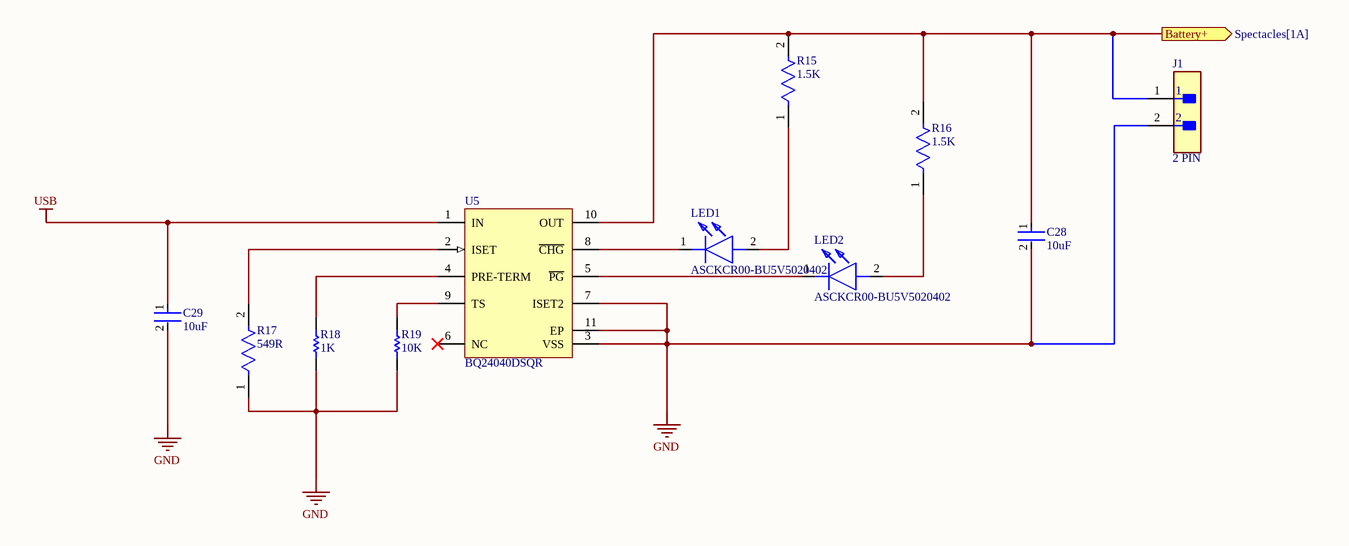
[diagram p6: Lipo Charger1.SchDoc]

### Parts
C28  10uF  [FP-CL10-IPC_A]
C29  10uF  [FP-CL10-IPC_A]
J1  2 PIN  [FP-B2B-XH-AM_LF_SN-MFG]
LED1  ASCKCR00-BU5V5020402  [ASCKCR00BU5V5020402]
LED2  ASCKCR00-BU5V5020402  [ASCKCR00BU5V5020402]
R15  1.5K  [FP-CRCW0603-e3-IPC_A]
R16  1.5K  [FP-CRCW0603-e3-IPC_A]
R17  549R  [FP-CRCW0603-e3-IPC_B]
R18  1K  [RESC1609X50X30NL8T20]
R19  10K  [RESC1609X50X30NL8T20]
U5  BQ24040DSQR  [DSQ0010A_V]

### Ports
Battery+ (out, see Spectacles[1A])

### Nets
GND: C28.2 C29.2 J1.2 R17.1 R18.1 R19.1 U5.3(VSS) U5.7(ISET2) U5.11(EP)
USB: C29.1 U5.1(IN)
NetC28_1: C28.1 J1.1 R15.2 R16.2 U5.10(OUT) ; port Battery+
NetLED1_1: LED1.1(K) U5.8(~{CHG})
NetLED1_2: LED1.2(A) R15.1
NetLED2_1: LED2.1(K) U5.5(~{PG})
NetLED2_2: LED2.2(A) R16.1
NetR17_2: R17.2 U5.2(ISET)
NetR18_2: R18.2 U5.4(PRE-TERM)
NetR19_2: R19.2 U5.9(TS)

Not connected (* = marked no-connect by the designer): U5 6(NC)*

### Notes on the sheet
- Title:
- Drawn By:
- Page Contents:
- Checked By:
- Subtitle:
- University Of Moratuwa
- Moratuwa
- Size:
- Date:
- File:
- Email:
- A4
- lasithnawanjaan123@gmail.com
- Lasith Haputhanthri
- Number:
- Time:
- Revision:
- Sheet
- of
- Katubedda
- 10500
- Sri Lanka

### Library data of the parts
C28 C29 = CMP-13271-000587-1: as C1 on sheet Driven Right Leg; Case/Package: 0603; Depth: 0.8mm; Max Operating Temperature: 125°C; Lead Free: Lead Free; Material: Ceramic; Voltage Rating: 50V; Min Operating Temperature: -55°C; Voltage Rating (DC): 50V; Dielectric: X7R; Height: 0.8mm; Capacitance: 100nF; Thickness: 0.035inch; Radiation Hardening: No; Voltage: 50V; Packaging: Tape and Reel; Length: 1.6mm; Tolerance: 10%; Width: 0.031inch; Mount: Surface Mount; Package Quantity: 10000
J1 = CMP-17439-000037-1: CONN HEADER VERT 2POS 2.5MM; Max Voltage Rating (AC): 250V; Connector Type: Male Pin; Contact Resistance: 20mR; Max Current Rating: 3A; Number of Positions: 2; Series: XH; Contact Material: Brass; Mount: Through Hole; Housing Material: Polyamide; Contact Plating: Tin; Termination: Solder; Max Operating Temperature: 85°C; Depth: 5.75mm; Packaging: Bulk; Min Operating Temperature: -25°C; Contact Type: Male Pin; Color: Green; Pitch: 2.5mm; Length: 7.4mm; Lead Free: Lead Free; Number of Rows: 1; Fastening Type: Detent; Housing Color: White; Orientation: Straight
LED1 LED2 = ASCKCR00-BU5V5020402: LED; Manufacturer_Name: Avago Technologies; Datasheet Link: https://docs.broadcom.com/doc/ASCKCx00-xxxxx0x0x02-DS; Height: 0.75mm; Manufacturer_Part_Number: ASCKCR00-BU5V5020402; Mouser Part Number: 630-ASCKCR00BU5V5020; Mouser Price/Stock: https://www.mouser.co.uk/ProductDetail/Broadcom-Avago/ASCKCR00-BU5V5020402?qs=OcgtsXO%252B3gu355%2FiA8jcWA%3D%3D
R15 R16 = CMP-2000-02995-2: RES Thick Film, 1.5kΩ, 1%, 0.1W, 100ppm/°C, 0603; Working Voltage: 75V; Power Rating: 100mW; Resistance: 1.5kR; Max Operating Temperature: 155°C; Features: Automotive AEC-Q200; Min Operating Temperature: -55°C; Width: 0.033inch; Case/Package: 0603; Voltage Rating (DC): 75V; Termination: SMD/SMT; Mount: Surface Mount; Weight: 7.1E-05oz; Case Code (Metric): 1608; Height: 0.45mm; Voltage Rating: 75V; Length: 1.55mm; Package Quantity: 10; Lead Free: Lead Free; Composition: Thick Film; Packaging: Tape and Reel; Temperature Coefficient: 100ppm/°C; Tolerance: 1%; Military Standard: Not; Case Code (Imperial): 0603; Number of Terminations: 2; Max Power Dissipation: 100mW; Depth: 0.85mm; Contact Plating: Tin
R17 = CMP-2000-03457-2: RES Thick Film, 549Ω, 1%, 0.1W, 100ppm/°C, 0603; Power Rating: 100mW; Voltage Rating: 75V; Composition: Thick Film; Resistance: 549R; Packaging: Tape and Reel; Max Operating Temperature: 155°C; Features: Automotive AEC-Q200; Temperature Coefficient: 100ppm/°C; Number of Terminations: 2; Radiation Hardening: No; Height: 0.45mm; Min Operating Temperature: -55°C; Width: 0.033inch; Number of Pins: 2; Contact Plating: Tin; Tolerance: 1%; Weight: 7.1E-05oz; Length: 1.55mm; Max Power Dissipation: 100mW; Depth: 0.85mm; Case Code (Metric): 1608; Case Code (Imperial): 0603; Package Quantity: 10; Military Standard: Not; Case/Package: 0603; Termination: SMD/SMT
R18 R19 = CMP-1666-00005-4: Chip Resistor, 10 KOhm, +/- 1%, 100 mW, -55 to 155 degC, 0603 (1608 Metric), RoHS, Tape and Reel; Manufacturer: Vishay Semiconductor; Voltage Rating: 75 V; Max Operating Temperature: 155 degC; PackageDescription: 2-Pin Surface Mount Device, Body 1.575 x 0.85 mm; ComponentLink1Description: Manufacturer URL; RoHSCompliant: true; PackageReference: 0603; REACH SVHC: Unknown; Length: 1.55 mm; DatasheetVersion: 06/2012; Packaging: Tape and Reel; Min Operating Temperature: -55 degC; Mounting Technology: Surface Mount; ComponentLink2URL: https://datasheet.ciiva.com/11809/0900766b80d98afc-11809037.pdf; Height: 0.45 mm; ComponentLink2Description: Datasheet; Package Quantity: 5000; ComponentLink1URL: http://www.vishay.com/
U5 = CMP-0321-00456-2: 800 mA, Single-Input, Single Cell Li-Ion Battery Charger with Auto Start. Vovp=6.6 V, 3.5 V, -40 to 85 degC, 10-pin SON (DSQ), Green (RoHS & no Sb/Br); Manufacturer: Texas Instruments; NiCd: N; Vin(Min)(V): 3.5; SubFamily: Battery Charge Management; PackageDescription: 10-Pin Plastic Small Outline No-Lead, 2 x 2 x 0.8 mm Body, 0.4 mm Pitch, Exposed Pad; PackageVersion: revB, Apr-2010; Mounting Technology: Surface Mount; Eco-Plan: Green (RoHS & no Sb/Br); ComponentLink1URL: http://www.ti.com/general/docs/lit/getliterature.tsp?genericPartNumber=BQ24040&fileType=pdf; PartNumber: BQ24040DSQR; DatasheetVersion: SLUS941A; Over Voltage Protection: N; PackageReference: DSQ0010A; NiMH: N; Li-Ion: N; Lead Acid: N; Li-Polymer: N; ComponentLink1Description: Datasheet

## Sheet Cording.SchDoc: Title
size A4; Date: *******; ApprovedBy: *******; CheckedBy: None; Author: *******; CompanyName: *******; DrawnBy: Name; Engineer: *******; Organization: *******; Address1: *******; Address2: *******; Address3: *******; Address4: *******; DocumentNumber: Doc Num; Revision: *******; SheetNumber: 9; SheetTotal: 9; Subtitle: Subtitle; Project: Project; VersionRevision: VersionRevision; TotalSheet: TotalSheet; CurrentTime: *******; CurrentDate: *******; Time: *******; DocumentFullPathAndName: *******; DocumentName: *******; ModifiedDate: *******; ImagePath: *******; ProjectName: *******; Application_BuildNumber: *******
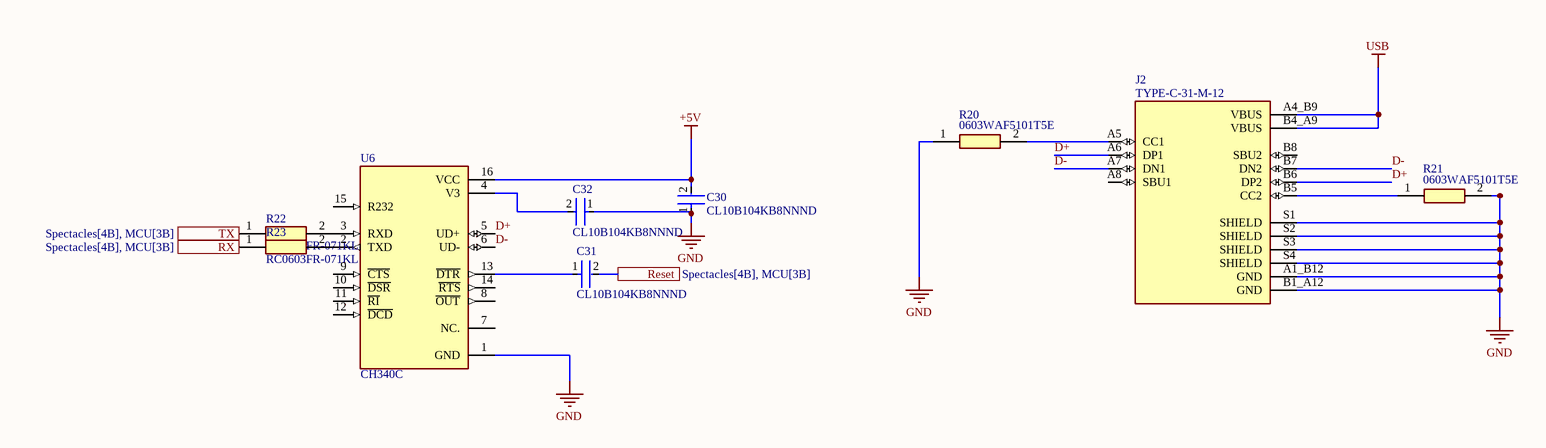
[diagram p7: Cording.SchDoc]

### Parts
C30  CL10B104KB8NNND  [FP-CL10-IPC_A]
C31  CL10B104KB8NNND  [FP-CL10-IPC_A]
C32  CL10B104KB8NNND  [FP-CL10-IPC_A]
J2  TYPE-C-31-M-12  [HRO_TYPE-C-31-M-12]
R20  0603WAF5101T5E  [RESC1608X55N]
R21  0603WAF5101T5E  [RESC1608X55N]
R22  RC0603FR-071KL  [RESC1608X55N]
R23  RC0603FR-071KL  [RESC1608X55N]
U6  CH340C  [SOIC127P600X180-16N]

### Ports
Reset (see Spectacles[4B], MCU[3B]), RX (see Spectacles[4B], MCU[3B]), TX (see Spectacles[4B], MCU[3B])

### Nets
+5V: C30.2 U6.16(VCC)
GND: C30.1 C32.1 J2.A1_B12(GND) J2.B1_A12(GND) J2.S1(SHIELD) J2.S2(SHIELD) J2.S3(SHIELD) J2.S4(SHIELD) R20.1 R21.2 U6.1(GND)
USB: J2.A4_B9(VBUS) J2.B4_A9(VBUS)
D+: J2.A6(DP1) J2.B6(DP2) U6.5(UD+)
D-: J2.A7(DN1) J2.B7(DN2) U6.6(UD-)
RST: C31.2 ; port Reset
NetC31_1: C31.1 U6.13(~{DTR})
NetC32_2: C32.2 U6.4(V3)
NetJ2_A5: J2.A5(CC1) R20.2
NetJ2_B5: J2.B5(CC2) R21.1
NetR22_1: R22.1 ; port TX
NetR22_2: R22.2 U6.3(RXD)
NetR23_1: R23.1 ; port RX
NetR23_2: R23.2 U6.2(TXD)

Not connected (* = marked no-connect by the designer): J2 A8(SBU1) B8(SBU2); U6 7(NC.) 8(~{OUT}) 9(~{CTS}) 10(~{DSR}) 11(~{RI}) 12(~{DCD}) 14(~{RTS}) 15(R232)

### Notes on the sheet
- Title:
- Drawn By:
- Page Contents:
- Checked By:
- Subtitle:
- University Of Moratuwa
- Moratuwa
- Size:
- Date:
- File:
- Email:
- A4
- lasithnawanjaan123@gmail.com
- Lasith Haputhanthri
- Number:
- Time:
- Revision:
- Sheet
- of
- Katubedda
- 10500
- Sri Lanka

### Library data of the parts
C30-C32 = CMP-13271-000587-1: as C1 on sheet Driven Right Leg; Case/Package: 0603; Depth: 0.8mm; Max Operating Temperature: 125°C; Lead Free: Lead Free; Material: Ceramic; Voltage Rating: 50V; Min Operating Temperature: -55°C; Voltage Rating (DC): 50V; Dielectric: X7R; Height: 0.8mm; Capacitance: 100nF; Thickness: 0.035inch; Radiation Hardening: No; Voltage: 50V; Packaging: Tape and Reel; Length: 1.6mm; Tolerance: 10%; Width: 0.031inch; Mount: Surface Mount; Package Quantity: 10000
J2 = TYPE-C-31-M-12: USB Connectors 24 Receptacle 1 8.94*7.3mm RoHS; MF: HRO Electronics Co., Ltd.; Price: None; Value: *; SnapEDA_Link: https://www.snapeda.com/parts/TYPE-C-31-M-12/HRO+Electronics+Co.%252C+Ltd./view-part/?ref=snap; Package: Package; Availability: Not in stock; Check_prices: https://www.snapeda.com/parts/TYPE-C-31-M-12/HRO+Electronics+Co.%252C+Ltd./view-part/?ref=eda; MP: TYPE-C-31-M-12
R20 R21 = 0603WAF5101T5E: Resistor; Manufacturer_Name: UNI-ROYAL(Uniroyal Elec); Datasheet Link: https://datasheet.lcsc.com/szlcsc/Uniroyal-Elec-0603WAF5101T5E_C23186.pdf; Height: 0.55mm; Manufacturer_Part_Number: 0603WAF5101T5E
R22 R23 = RC0603FR-071KL: Resistor; Manufacturer_Name: YAGEO; Datasheet Link: https://www.yageo.com/upload/media/product/productsearch/datasheet/rchip/PYu-RC_Group_51_RoHS_L_12.pdf; Height: 0.55mm; Manufacturer_Part_Number: RC0603FR-071KL; Mouser Part Number: 603-RC0603FR-071KL; Mouser Price/Stock: https://www.mouser.co.uk/ProductDetail/YAGEO/RC0603FR-071KL?qs=VU8sRB4EgwApHsk4rF%2F3zg%3D%3D; Arrow Part Number: RC0603FR-071KL; Arrow Price/Stock: https://www.arrow.com/en/products/rc0603fr-071kl/yageo?region=nac
U6 = CH340C: USB to serial chip CH340; MF: WCH; Price: None; Availability: Not in stock; MP: CH340C; Package: None; SnapEDA_Link: https://www.snapeda.com/parts/CH340C/WCH/view-part/?ref=snap; Check_prices: https://www.snapeda.com/parts/CH340C/WCH/view-part/?ref=eda; Value: *

## Nets that join several sheets
+5V: Driven Right Leg (R1.1 U1.4), Instrumental Amplifire (U1.4), MCU (7 pins), Cording (C30.2 U6.16)
GND: Driven Right Leg (C1.2 R3.2 U1.11), Instrumental Amplifire (U1.11), MCU (14 pins), NRF Module (16 pins), Lipo Charger1 (9 pins), Cording (11 pins)
USB: Lipo Charger1 (C29.1 U5.1), Cording (J2.A4_B9 J2.B4_A9)
CE: MCU (U2.12), NRF Module (IC1.1)
CSN: MCU (U2.11), NRF Module (IC1.2)
MISO: MCU (U2.16), NRF Module (IC1.5)
MOSI: MCU (U2.15), NRF Module (IC1.4)
NetDuty1_1: Electrodes (Duty1.1), Instrumental Amplifire (U1.5)
NetDuty1_2: Electrodes (Duty1.2), Instrumental Amplifire (U1.3)
NetDuty1_3: Electrodes (Duty1.3), Driven Right Leg (R2.2)
NetR2_1: Driven Right Leg (R2.1 U1.8 U1.9), Instrumental Amplifire (R7.2)
NetR5_1: Instrumental Amplifire (R5.1 U1.7), MCU (U2.23)
NetR22_1: MCU (U2.30), Cording (R22.1)
NetR23_1: MCU (U2.31), Cording (R23.1)
RST: MCU (5 pins), Cording (C31.2)
SCK: MCU (U2.17), NRF Module (IC1.3)